# Altium schematic sheet test.SchDoc
size A4
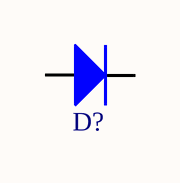
[diagram p0: test.SchDoc]

## Parts
D?  1N4148WS  [SOD323]  (value not drawn)

## Nets

Not connected (* = marked no-connect by the designer): D? 1(A) 2(K)

## Library data of the parts
D? = 1N4148WS: Diode; Mouser: http://www.mouser.com/Semiconductors/Discrete-Semiconductors/Diodes-Rectifiers/Diodes-General-Purpose-Power-Switching/_/N-ax1mp?P=1z0z5meZ1z0xoywZ1z0sou6&Ns=Pricing%7c0